# Altium schematic sheet current-meter.SchDoc
size A3
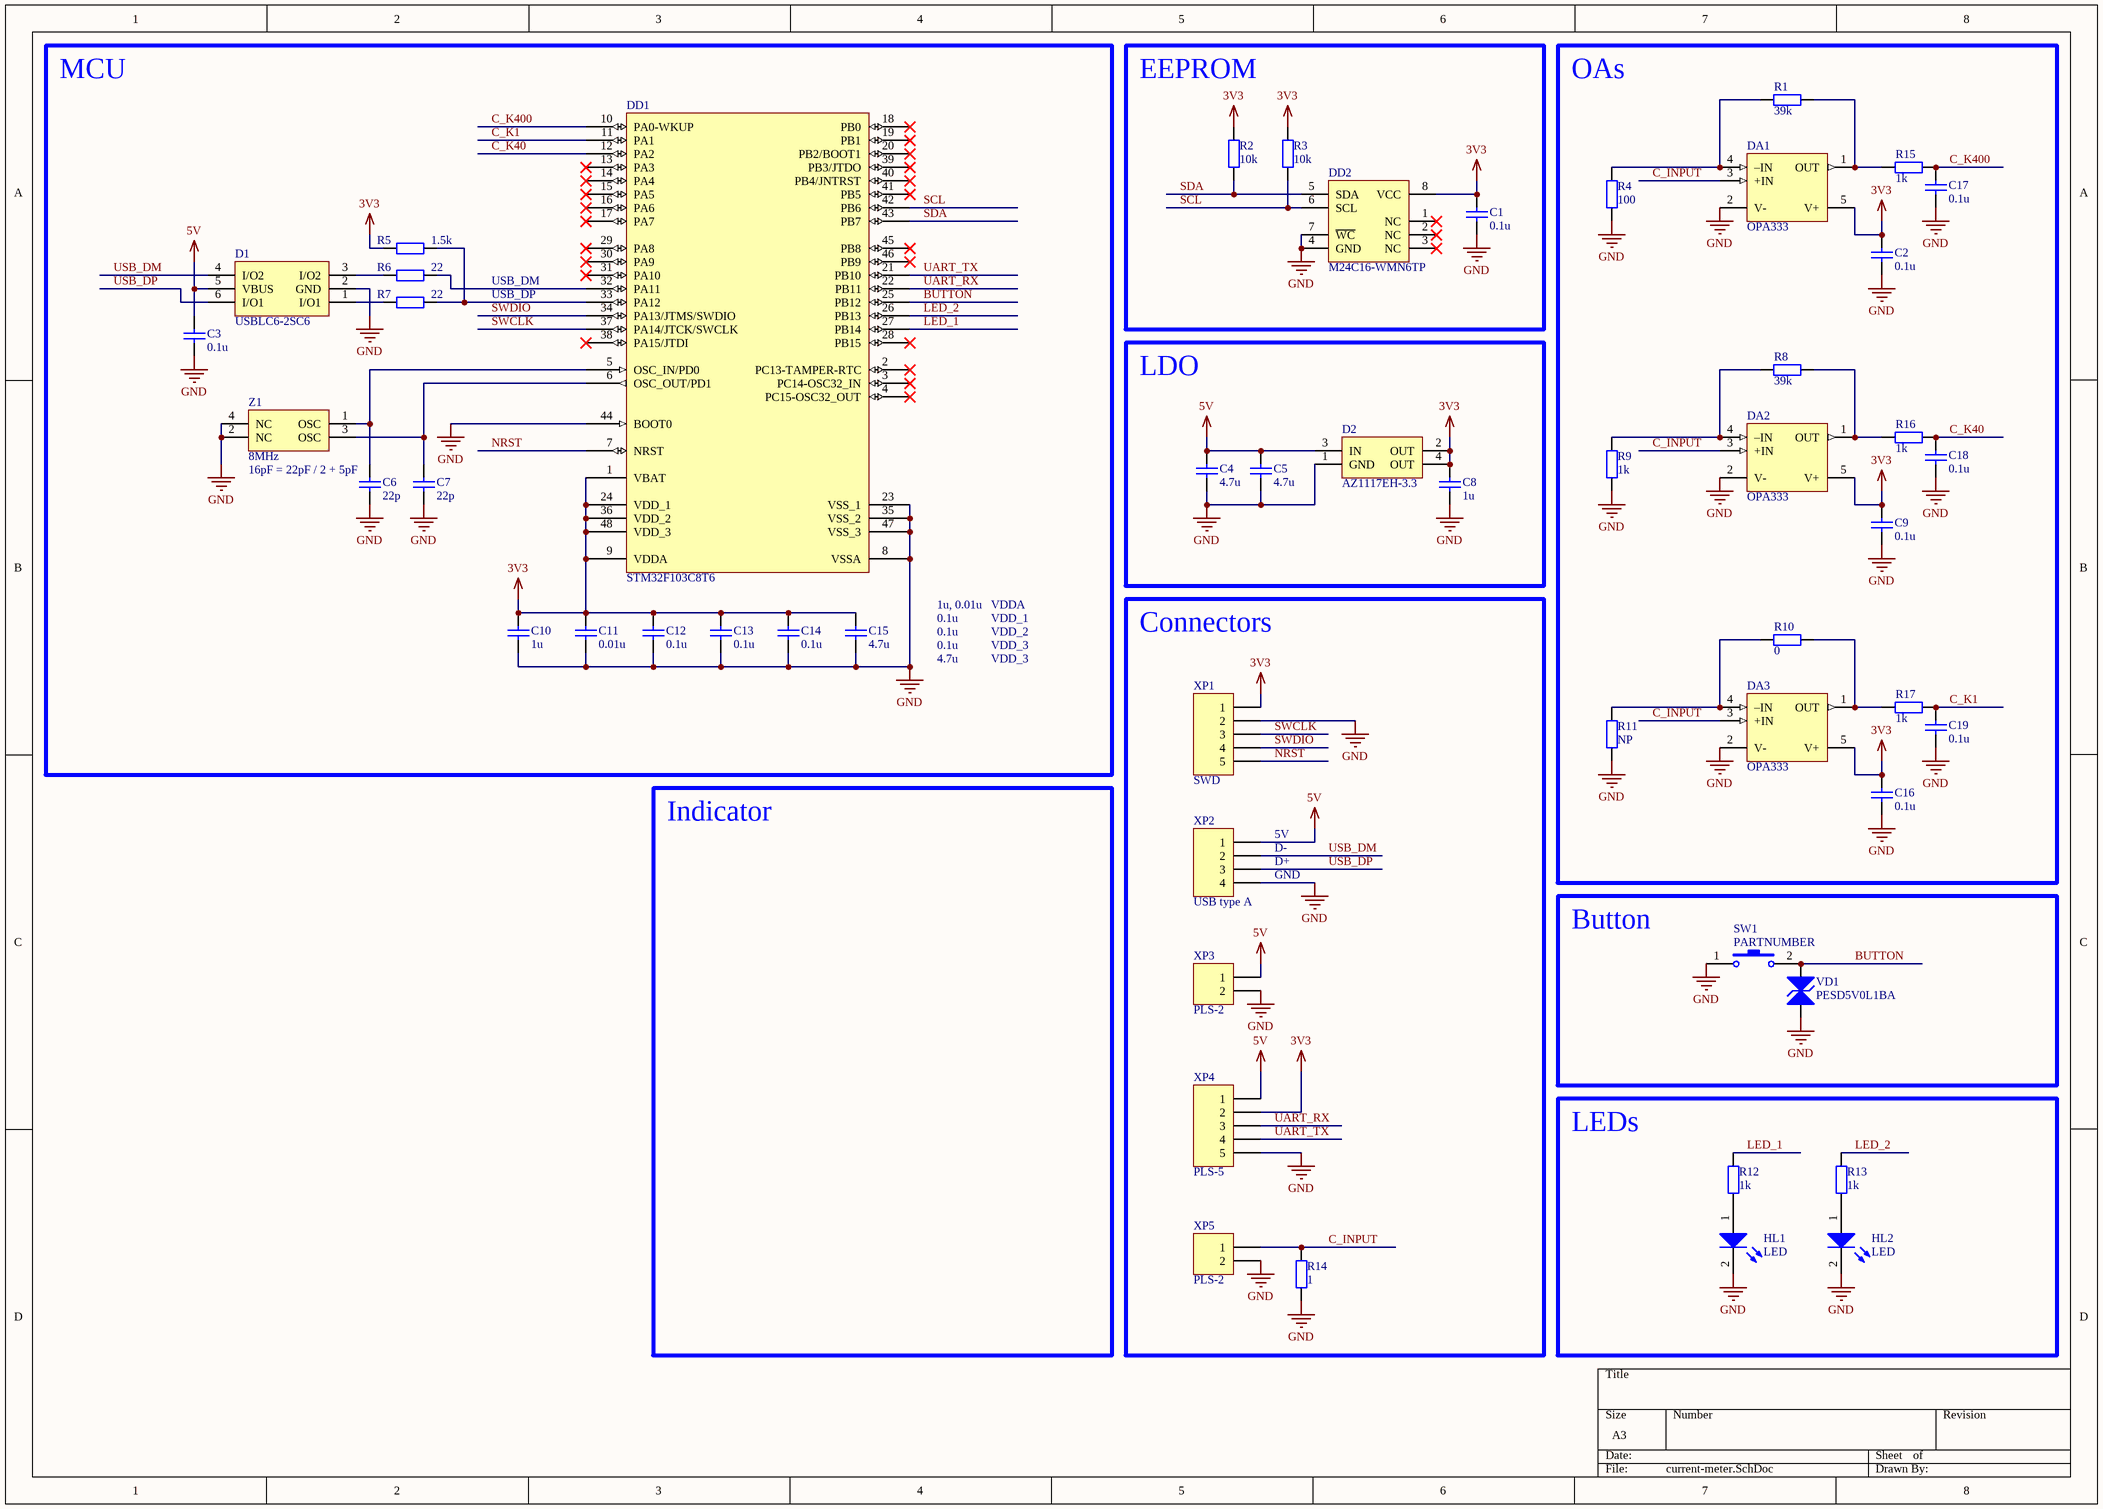
[diagram p0: current-meter.SchDoc]

## Parts
C1  0.1u  [0603-CAP]
C2  0.1u  [0603-CAP]
C3  0.1u  [0603-CAP]
C4  4.7u  [0805-CAP]
C5  4.7u  [0805-CAP]
C6  22p  [0603-CAP]
C7  22p  [0603-CAP]
C8  1u  [0805-CAP]
C9  0.1u  [0603-CAP]
C10  1u  [0805-CAP]
C11  0.01u  [0603-CAP]
C12  0.1u  [0603-CAP]
C13  0.1u  [0603-CAP]
C14  0.1u  [0603-CAP]
C15  4.7u  [0805-CAP]
C16  0.1u  [0603-CAP]
C17  0.1u  [0603-CAP]
C18  0.1u  [0603-CAP]
C19  0.1u  [0603-CAP]
D1  USBLC6-2SC6  [SOT-23-6L]
D2  AZ1117EH-3.3  [SOT-223]
DA1  OPA333  [SOT-23-5]
DA2  OPA333  [SOT-23-5]
DA3  OPA333  [SOT-23-5]
DD1  STM32F103C8T6  [LQFP48]
DD2  M24C16-WMN6TP  [SOIC8]
HL1  LED  [0603-LED]
HL2  LED  [0603-LED]
R1  39k  [0603-RES]
R2  10k  [0603-RES]
R3  10k  [0603-RES]
R4  100  [0603-RES]
R5  1.5k  [0603-RES]
R6  22  [0603-RES]
R7  22  [0603-RES]
R8  39k  [0603-RES]
R9  1k  [0603-RES]
R10  0  [0603-RES]
R11  NP  [0603-RES]
R12  1k  [0603-RES]
R13  1k  [0603-RES]
R14  1  [1206-RES]
R15  1k  [0603-RES]
R16  1k  [0603-RES]
R17  1k  [0603-RES]
SW1  PARTNUMBER  [KLS7-TS3608-5.0-180]
VD1  PESD5V0L1BA  [SOD-323]
XP1  SWD  [PLS-5]
XP2  USB type A  [DS1098-B]
XP3  NO POP  [PLS-2]  (value not drawn)
XP4  PLS-5  [PLS-5]
XP5  NO POP  [PLS-2]  (value not drawn)
Z1  8MHz  [KX-9]

## Blocks framed on the sheet
MCU: C3 C6 C7 C10-C15 D1 DD1 R5-R7 Z1
EEPROM: C1 DD2 R2 R3
OAs: C2 C9 C16-C19 DA1-DA3 R1 R4 R8-R11 R15-R17
LDO: C4 C5 C8 D2
Connectors: R14 XP1-XP5
Button: SW1 VD1
LEDs: HL1 HL2 R12 R13

## Nets
3V3: C1.1 C2.2 C8.1 C9.2 C10.2 C11.2 C12.2 C13.2 C14.2 C15.2 C16.2 D2.2(OUT) D2.4(OUT) DA1.5(V+) DA2.5(V+) DA3.5(V+) DD1.1(VBAT) DD1.9(VDDA) DD1.24(VDD_1) DD1.36(VDD_2) DD1.48(VDD_3) DD2.8(VCC) R2.1 R3.1 R5.2 XP1.1 XP4.2
5V: C3.1 C4.1 C5.1 D1.5(VBUS) D2.3(IN) XP2.1 XP3.1 XP4.1
GND: C1.2 C2.1 C3.2 C4.2 C5.2 C6.2 C7.2 C8.2 C9.1 C10.1 C11.1 C12.1 C13.1 C14.1 C15.1 C16.1 C17.2 C18.2 C19.2 D1.2(GND) D2.1(GND) DA1.2(V-) DA2.2(V-) DA3.2(V-) DD1.8(VSSA) DD1.23(VSS_1) DD1.35(VSS_2) DD1.44(BOOT0) DD1.47(VSS_3) DD2.4(GND) DD2.7(~{WC}) HL1.2(K) HL2.2(K) R4.1 R9.1 R11.1 R14.1 SW1.1 VD1.2(K) XP1.2 XP2.4 XP3.2 XP4.5 XP5.2 Z1.2(NC) Z1.4(NC)
BUTTON: DD1.25(PB12) SW1.2 VD1.1(A)
C_INPUT: DA1.3(+IN) DA2.3(+IN) DA3.3(+IN) R14.2 XP5.1
C_K1: C19.1 DD1.11(PA1) R17.1
C_K40: C18.1 DD1.12(PA2) R16.1
C_K400: C17.1 DD1.10(PA0-WKUP) R15.1
LED_1: DD1.27(PB14) R12.2
LED_2: DD1.26(PB13) R13.2
NRST: DD1.7(NRST) XP1.5
SCL: DD1.42(PB6) DD2.6(SCL) R3.2
SDA: DD1.43(PB7) DD2.5(SDA) R2.2
SWCLK: DD1.37(PA14/JTCK/SWCLK) XP1.3
SWDIO: DD1.34(PA13/JTMS/SWDIO) XP1.4
UART_RX: DD1.22(PB11) XP4.3
UART_TX: DD1.21(PB10) XP4.4
USB_DM: D1.4(I/O2) XP2.2
USB_DP: D1.6(I/O1) XP2.3
NetC6_1: C6.1 DD1.5(OSC_IN/PD0) Z1.1(OSC)
NetC7_1: C7.1 DD1.6(OSC_OUT/PD1) Z1.3(OSC)
NetD1_1: D1.1(I/O1) R7.2
NetD1_3: D1.3(I/O2) R6.2
NetDA1_1: DA1.1(OUT) R1.2 R15.2
NetDA1_4: DA1.4(–IN) R1.1 R4.2
NetDA2_1: DA2.1(OUT) R8.2 R16.2
NetDA2_4: DA2.4(–IN) R8.1 R9.2
NetDA3_1: DA3.1(OUT) R10.2 R17.2
NetDA3_4: DA3.4(–IN) R10.1 R11.2
NetDD1_32: DD1.32(PA11) R6.1
NetDD1_33: DD1.33(PA12) R5.1 R7.1
NetHL1_1: HL1.1(A) R12.1
NetHL2_1: HL2.1(A) R13.1

Not connected (* = marked no-connect by the designer): DD1 2(PC13-TAMPER-RTC)* 3(PC14-OSC32_IN)* 4(PC15-OSC32_OUT)* 13(PA3)* 14(PA4)* 15(PA5)* 16(PA6)* 17(PA7)* 18(PB0)* 19(PB1)* 20(PB2/BOOT1)* 28(PB15)* 29(PA8)* 30(PA9)* 31(PA10)* 38(PA15/JTDI)* 39(PB3/JTDO)* 40(PB4/JNTRST)* 41(PB5)* 45(PB8)* 46(PB9)*; DD2 1(NC)* 2(NC)* 3(NC)*

## Notes on the sheet
- USB_DM
- USB_DP
- (near C6) 16pF = 22pF / 2 + 5pF
- 1u, 0.01u
- 0.1u
- VDDA
- VDD_1
- VDD_2
- VDD_3
- 4.7u
- Indicator
- (near XP2) 5V
- (near XP2) D-
- (near XP2) D+
- (near XP2) GND

## Library data of the parts
C1-C19 = Cap: PARTNUMBER
D2 = AZ1117EH-3.3: AZ1117EH-3.3TRG1
DA1-DA3 = OPA333: OPA333AIDBVR (TS321ILT)
HL1 HL2 = LED0: PARTNUMBER
R1-R17 = Res2: PARTNUMBER
SW1 = SW-PB
VD1 = TVS diode: PESD5V0L1BA,115
XP1 XP4 = Header 5: PARTNUMBER
XP2 = Header 4: PARTNUMBER
XP3 XP5 = Header 2: PLS-2; Type: PLS-2
Z1 = KX-9AT: 12.89048 (12.89007 -20+70)